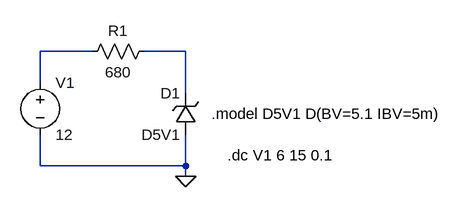
[diagram p0: schematic zener diode 2.asc]
zener diode 2.asc, the LTspice schematic file:
Version 4.1
SHEET 1 880 680
WIRE 144 96 64 96
WIRE 288 96 224 96
WIRE 64 144 64 96
WIRE 288 160 288 96
WIRE 64 272 64 224
WIRE 288 272 288 224
WIRE 288 272 64 272
WIRE 288 288 288 272
FLAG 288 288 0
SYMBOL voltage 64 128 R0
WINDOW 123 0 0 Left 0
WINDOW 39 0 0 Left 0
SYMATTR InstName V1
SYMATTR Value 12
SYMBOL res 240 80 R90
WINDOW 0 0 56 VBottom 2
WINDOW 3 32 56 VTop 2
SYMATTR InstName R1
SYMATTR Value 680
SYMBOL zener 304 224 R180
WINDOW 0 24 64 Left 2
WINDOW 3 24 0 Left 2
SYMATTR InstName D1
SYMATTR Value D5V1
TEXT 328 192 Left 2 !.model D5V1 D(BV=5.1 IBV=5m)
TEXT 352 256 Left 2 !.dc V1 6 15 0.1

The netlist it stands for:
* zener diode 2.asc
V1 N001 0 12
R1 N002 N001 680
D1 0 N002 D5V1
.model D D
.lib standard.dio
.model D5V1 D(BV=5.1 IBV=5m)
.dc V1 6 15 0.1
.backanno
.end